# EAGLE design foe-scale (EAGLE 7.4.0)
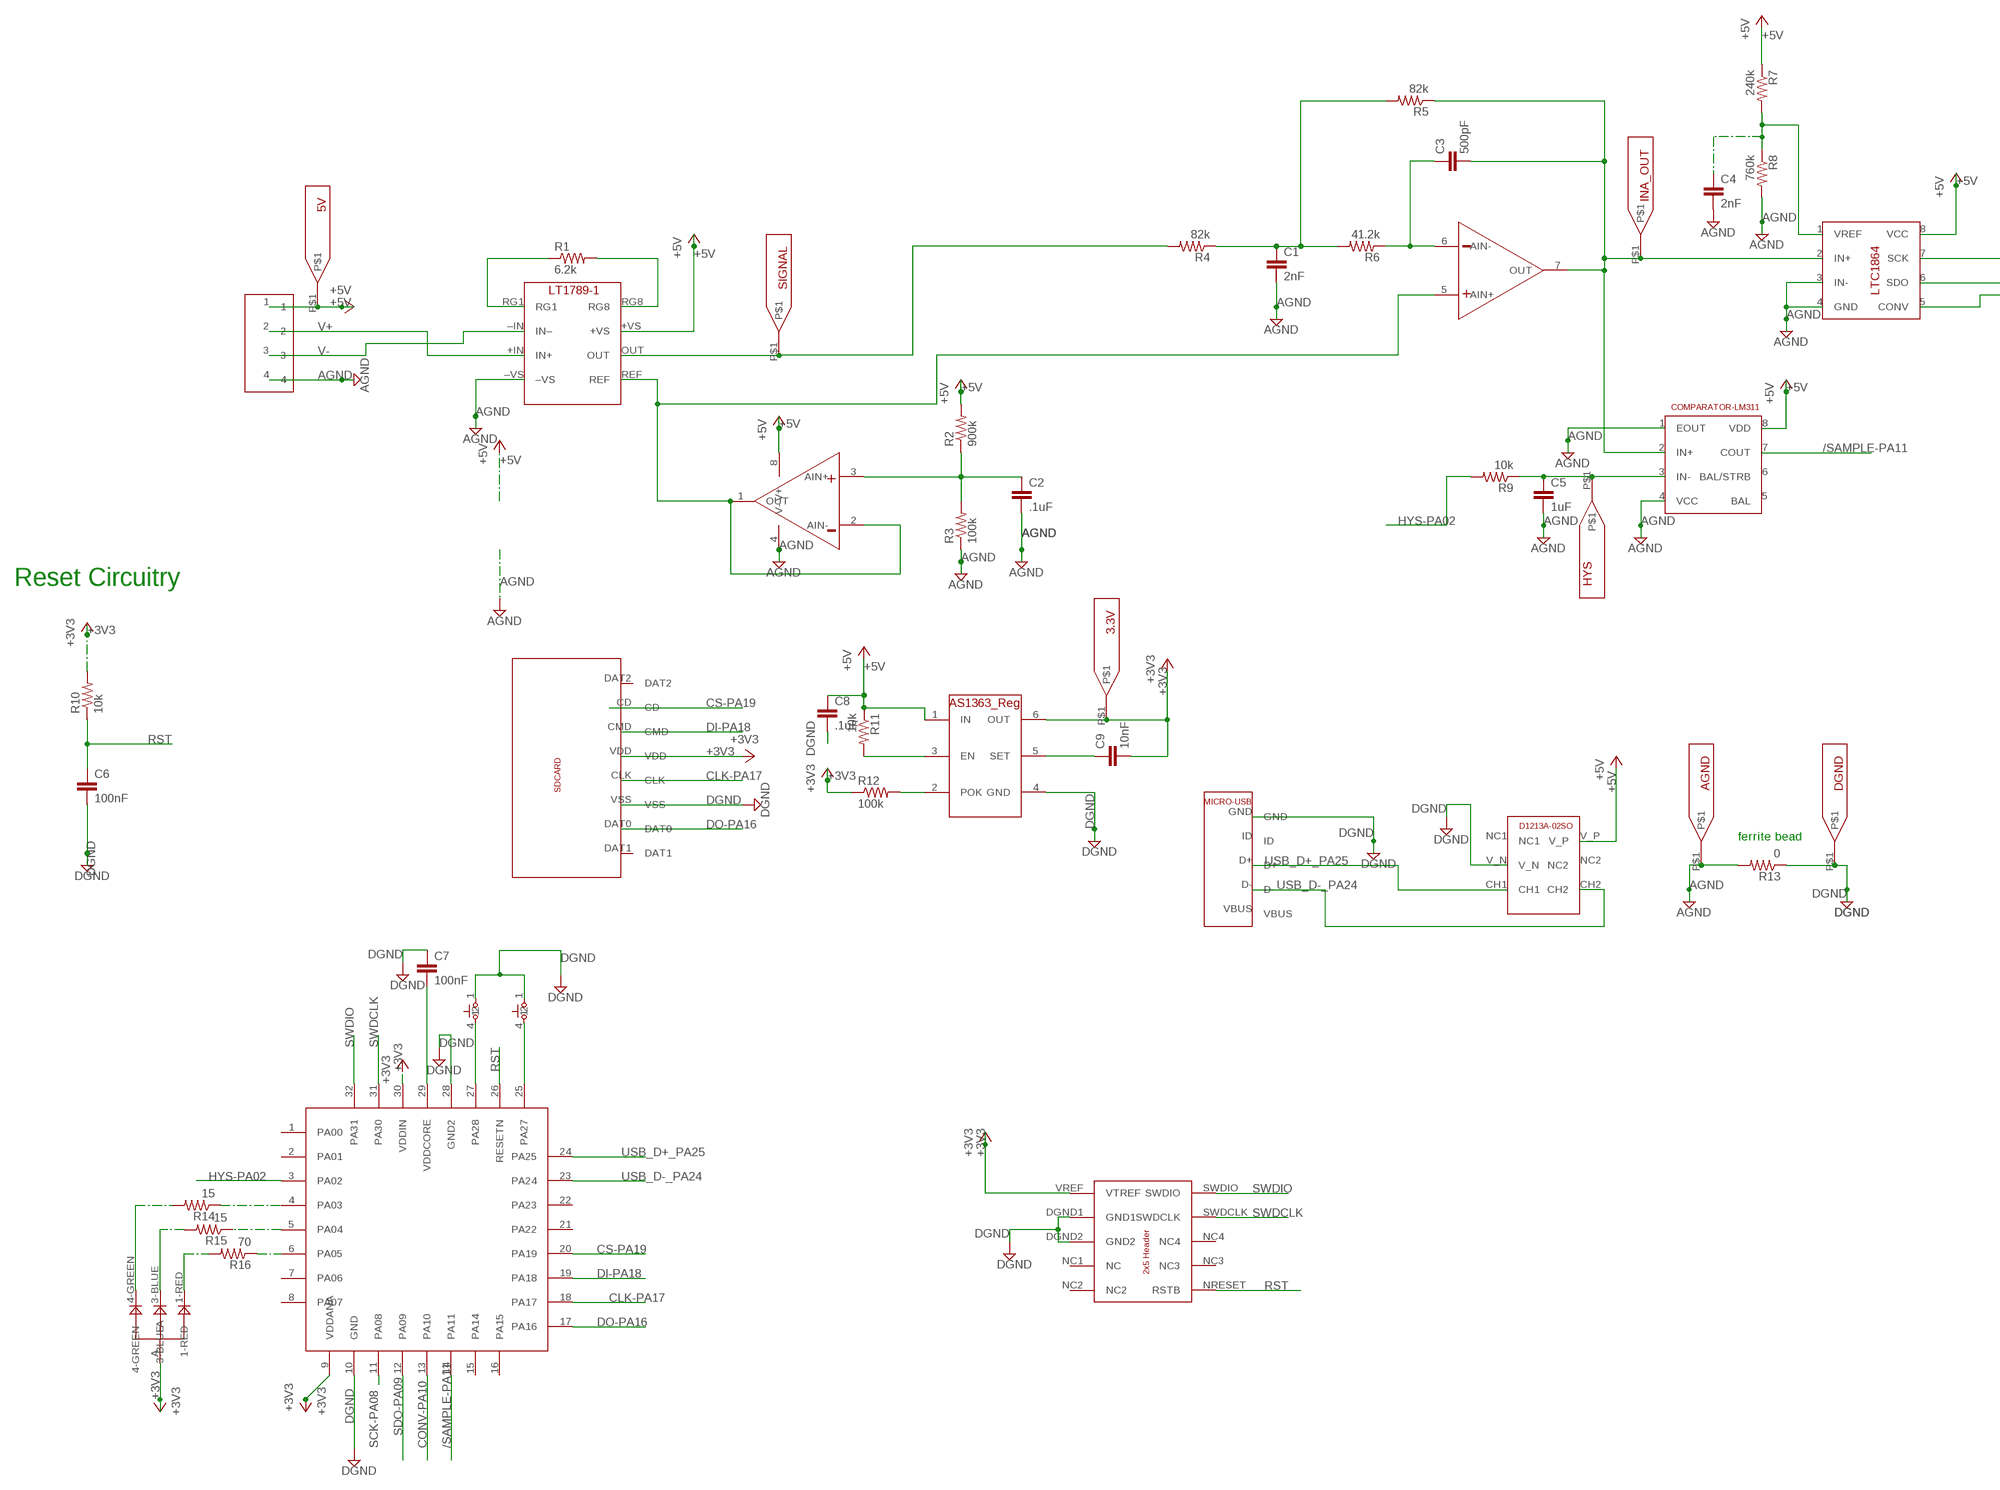
[diagram p0: schematic, sheet 1, part 1 of 2]
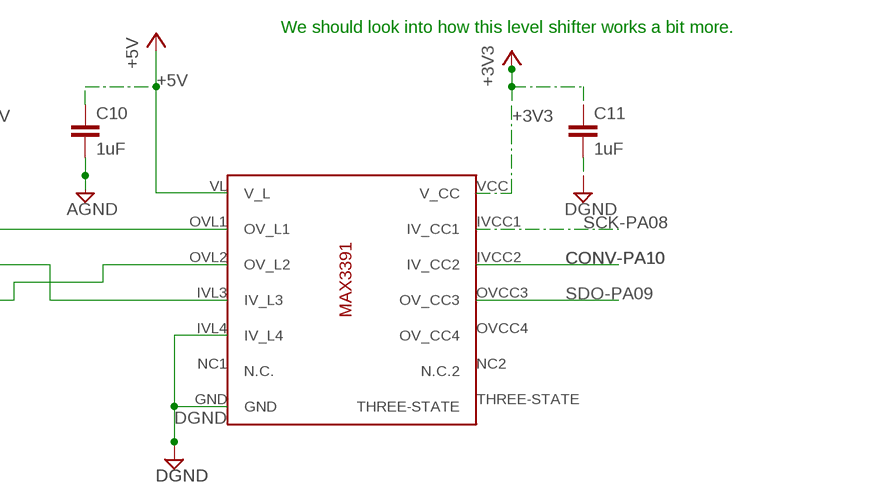
[diagram p1: schematic, sheet 1, part 2 of 2]

## Parts
3.3V  TEST_POINT  [TEST_POINT]
5V  TEST_POINT  [TEST_POINT]
AGND  TEST_POINT  [TEST_POINT]
AS1363  3.3V_AS1363  [SOT23-6]
C1  2nF  C-EUC0805K  [C0805K]
C2  .1uF  C-EUC0805K  [C0805K]
C3  500pF  C-EUC0805K  [C0805K]
C4  2nF  C-EUC0805K  [C0805K]
C5  1uF  C-EUC0805K  [C0805K]
C6  100nF  C-EUC0805K  [C0805K]
C7  100nF  C-EUC0805K  [C0805K]
C8  .1uF  C-EUC0805K  [C0805K]
C9  10nF  C-EUC0805K  [C0805K]
C10  1uF  C-EUC0805K  [C0805K]
C11  1uF  C-EUC0805K  [C0805K]
D1  D1213A-DIODE-ARRAY  [SOT26-DIODE-ARRAY]
DBG1  DEBUGHEAD  [DEBUGHEAD]
DGND  TEST_POINT  [TEST_POINT]
HYS  TEST_POINT  [TEST_POINT]
INA_OUT  TEST_POINT  [TEST_POINT]
R1  6.2k  R-US_R0805  [R0805]
R2  900k  R-US_R0805  [R0805]
R3  100k  R-US_R0805  [R0805]
R4  82k  R-US_R0805  [R0805]
R5  82k  R-US_R0805  [R0805]
R6  41.2k  R-US_R0805  [R0805]
R7  240k  R-US_R0805  [R0805]
R8  760k  R-US_R0805  [R0805]
R9  10k  R-US_R0805  [R0805]
R10  10k  R-US_R0805  [R0805]
R11  10k  R-US_R0805  [R0805]
R12  100k  R-US_R0805  [R0805]
R13  0  R-US_R0805  [R0805]
R14  15  R-US_R0805  [R0805]
R15  15  R-US_R0805  [R0805]
R16  70  R-US_R0805  [R0805]
SIGNAL  TEST_POINT  [TEST_POINT]
U1  LM311  [SOIC8]
U2  SAMD21E  [TQFP32-08]
U$1  1X04  [1X04]
U$2  LT1789-1-INSTR-AMP  [S8-LT1789-1]
U$3  LMC6482  [SOIC8]
U$6  ADC-LTC1864  [SOIC8]
U$7  LEVEL-SHIFTER  [TSSOP-14]
U$8  SDCARD_JACK  [MICRO_SDCARD]
U$10  RGBLED  [RGBLED]
U$11  BUTTON_THRU  [PUSHBTN]
U$12  BUTTON_THRU  [PUSHBTN]
U$13  MICRO-USB-CONNECTOR  [MICRO-USB-CONNECTOR]

## Nets
+3V3: 3.3V.P$1 AS1363.6(OUT) C9.2 C11.1 DBG1.VREF(VTREF) R10.2 R12.1 U2.9(VDDANA) U2.30(VDDIN) U$7.VCC(V_CC) U$8.VDD U$10.A
+5V: 5V.P$1 AS1363.1(IN) C8.1 C10.1 D1.V_P R2.2 R7.1 R11.1 U1.8(VDD) U$1.1 U$2.+VS U$3.8(V+) U$6.8(VCC) U$7.VL(V_L)
/SAMPLE-PA11: U1.7(COUT) U2.14(PA11)
AGND: AGND.P$1 C1.2 C2.2 C4.2 C5.2 C10.2 R3.1 R8.2 R13.2 U1.1(EOUT) U1.4(VCC) U$1.4 U$2.–VS U$3.4(V-) U$6.3(IN-) U$6.4(GND)
CLK-PA17: U2.18(PA17) U$8.CLK
CONV-PA10: U2.13(PA10) U$7.IVCC2(IV_CC2)
CS-PA19: U2.20(PA19) U$8.CD
DGND: AS1363.4(GND) C6.2 C7.1 C8.2 C11.2 D1.V_N DBG1.DGND1(GND1) DBG1.DGND2(GND2) DGND.P$1 R13.1 U2.10(GND) U2.28(GND2) U$7.GND U$7.IVL4(IV_L4) U$8.VSS U$11.1 U$12.1 U$13.GND
DI-PA18: U2.19(PA18) U$8.CMD
DO-PA16: U2.17(PA16) U$8.DAT0
HYS-PA02: R9.2 U2.3(PA02)
N$1: R14.1 U2.4(PA03)
N$2: U2.27(PA28) U$12.4
N$3: U2.25(PA27) U$11.4
N$4: R15.1 U2.5(PA04)
N$5: R1.1 U$2.RG1
N$6: R1.2 U$2.RG8
N$7: R4.2 SIGNAL.P$1 U$2.OUT
N$8: R16.1 U2.6(PA05)
N$10: C2.1 R2.1 R3.2 U$3.3(AIN+)
N$16: U$2.REF U$3.1(OUT) U$3.2(AIN-) U$3.5(AIN+)
N$18: C1.1 R4.1 R5.2 R6.2
N$19: C3.2 INA_OUT.P$1 R5.1 U1.2(IN+) U$3.7(OUT) U$6.2(IN+)
N$20: C3.1 R6.1 U$3.6(AIN-)
N$23: C4.1 R7.2 R8.1 U$6.1(VREF)
N$27: C5.1 HYS.P$1 R9.1 U1.3(IN-)
N$34: U$6.7(SCK) U$7.OVL1(OV_L1)
N$35: U$6.5(CONV) U$7.OVL2(OV_L2)
N$36: U$6.6(SDO) U$7.IVL3(IV_L3)
N$45: C7.2 U2.29(VDDCORE)
N$48: R14.2 U$10.4-GREEN
N$49: R15.2 U$10.3-BLUE
N$50: R16.2 U$10.1-RED
N$64: AS1363.3(EN) R11.2
N$67: AS1363.5(SET) C9.1
N$70: AS1363.2(POK) R12.2
RST: C6.1 DBG1.NRESET(RSTB) R10.1 U2.26(RESETN)
SCK-PA08: U2.11(PA08) U$7.IVCC1(IV_CC1)
SDO-PA09: U2.12(PA09) U$7.OVCC3(OV_CC3)
SWDCLK: DBG1.SWDCLK U2.31(PA30)
SWDIO: DBG1.SWDIO U2.32(PA31)
USB_D+_PA25: D1.CH1 U2.24(PA25) U$13.D+
USB_D-_PA24: D1.CH2 U2.23(PA24) U$13.D-
V+: U$1.2 U$2.+IN(IN+)
V-: U$1.3 U$2.–IN(IN–)
Unconnected: D1.NC1 D1.NC2 DBG1.NC1(NC) DBG1.NC2 DBG1.NC3 DBG1.NC4 U1.5(BAL) U1.6(BAL/STRB) U2.1(PA00) U2.2(PA01) U2.7(PA06) U2.8(PA07) U2.15(PA14) U2.16(PA15) U2.21(PA22) U2.22(PA23) U$7.NC1(N.C.) U$7.NC2(N.C.2) U$7.OVCC4(OV_CC4) U$7.THREE-STATE U$8.DAT1 U$8.DAT2 U$13.ID U$13.VBUS

## Notes on the sheet
- We should look into how this level shifter works a bit more.
- Reset Circuitry
- ferrite bead

## Library data of the parts
3.3V 5V AGND DGND HYS INA_OUT SIGNAL = foe-scale:TEST_POINT
AS1363 = foe-scale:3.3V_AS1363
C1-C11 = rcl:C-EU: CAPACITOR, European symbol
D1 = foe-scale:D1213A-DIODE-ARRAY
DBG1 = foe-scale:DEBUGHEAD
R1-R16 = resistor:R-US_: RESISTOR, American symbol
U1 = foe-scale:LM311
U2 = foe-scale:SAMD21E
U$1 = foe-scale:1X04
U$2 = foe-scale:LT1789-1-INSTR-AMP
U$3 = foe-scale:LMC6482
U$6 = foe-scale:ADC-LTC1864
U$7 = foe-scale:LEVEL-SHIFTER
U$8 = foe-scale:SDCARD_JACK
U$10 = foe-scale:RGBLED
U$11 U$12 = foe-scale:BUTTON_THRU
U$13 = foe-scale:MICRO-USB-CONNECTOR

## Board
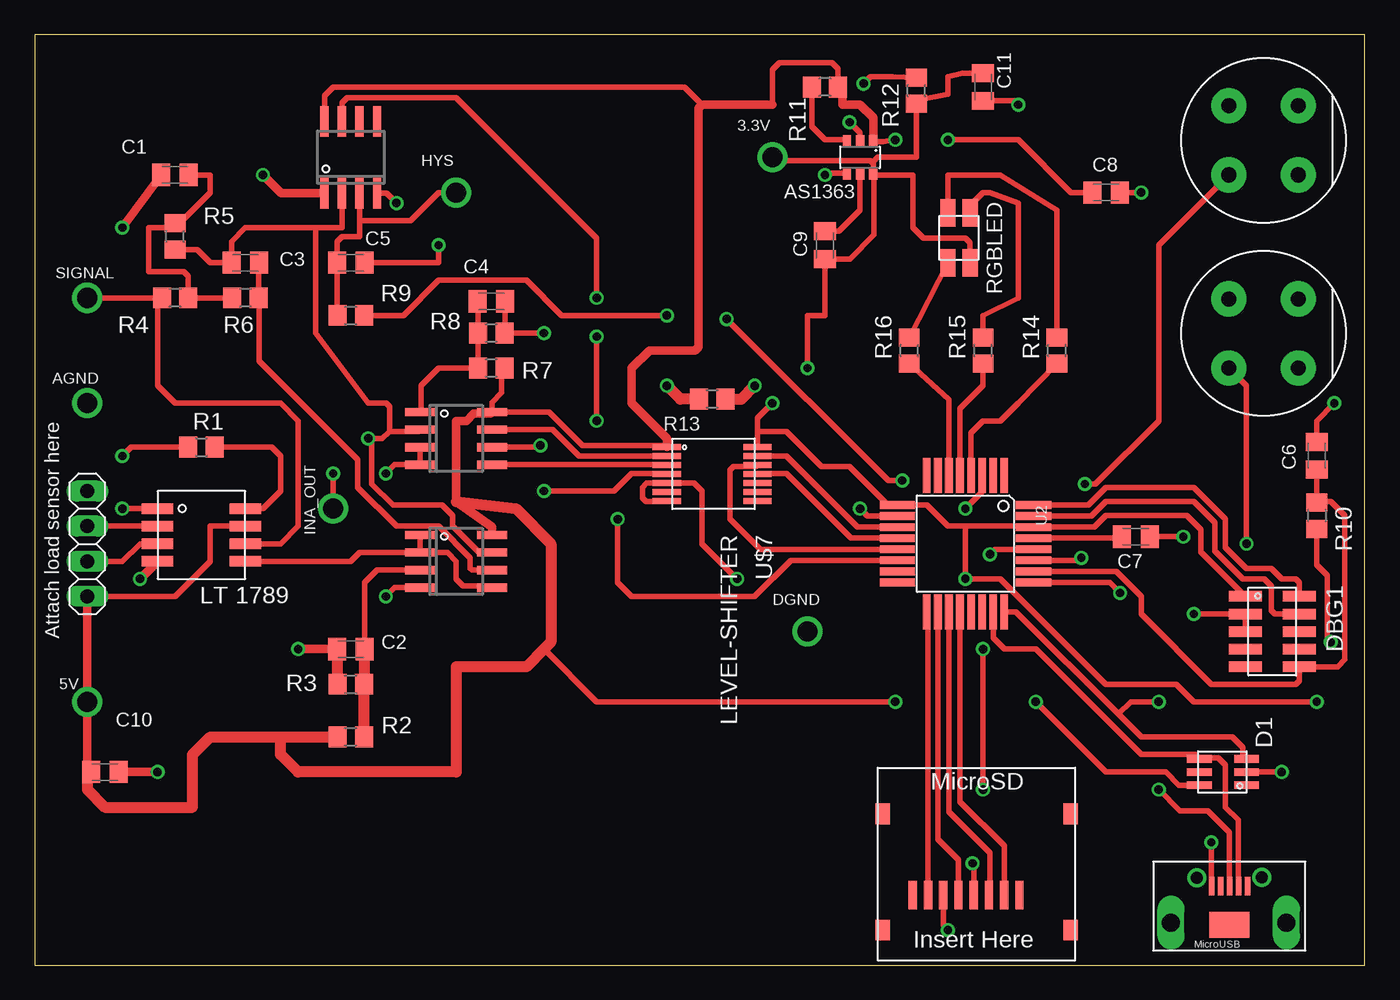
[diagram p2: board, top side]
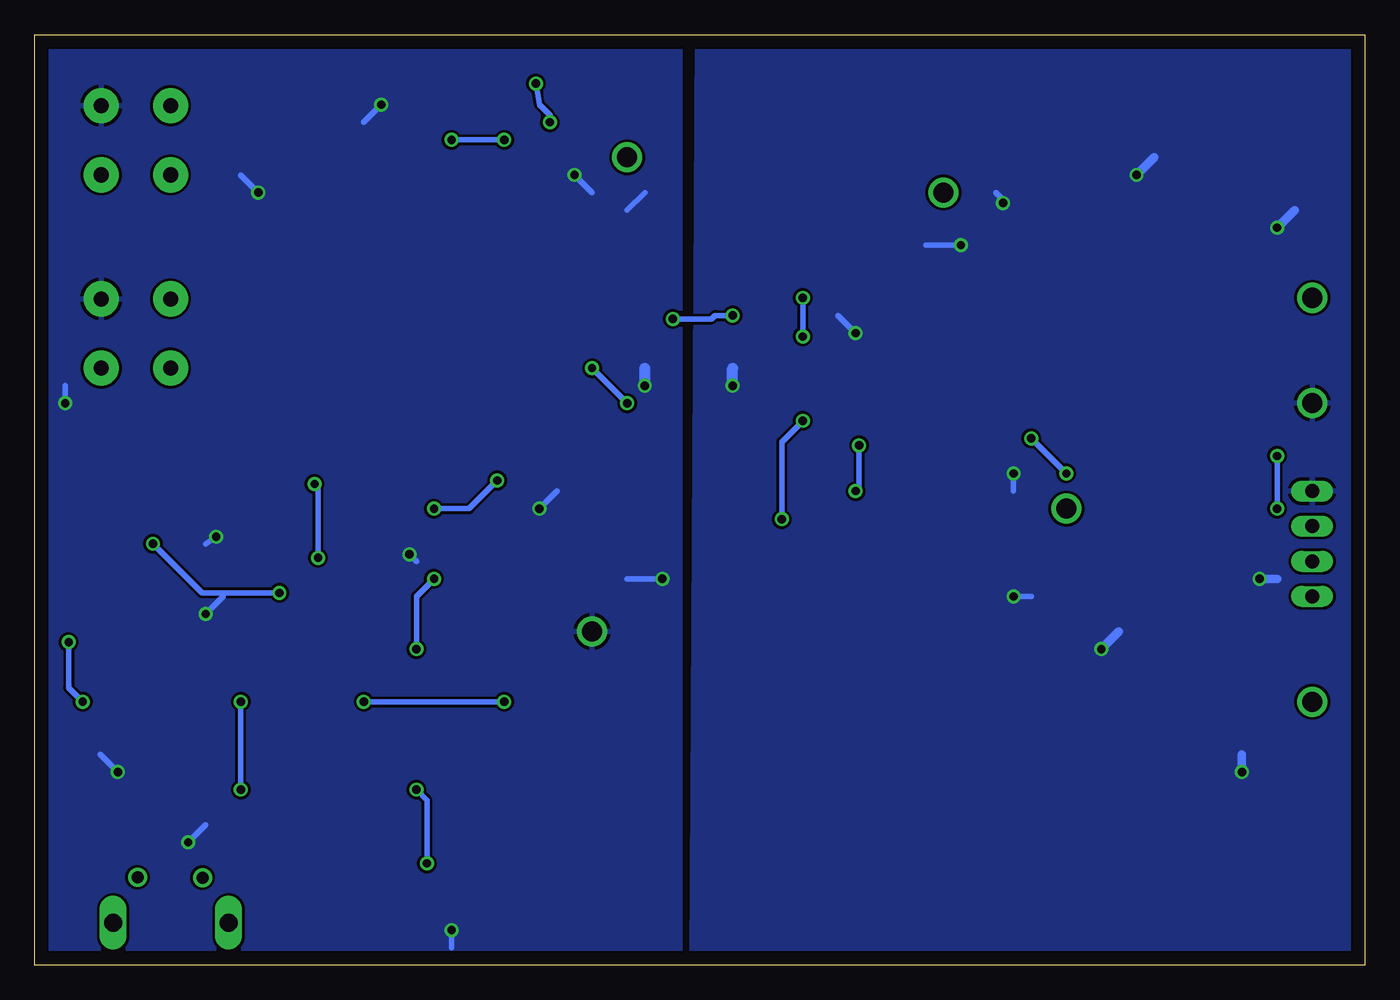
[diagram p3: board, bottom side, seen from below]

Size 96.19 x 67.3 mm. Coordinates in mm from the lower left corner, seen from the top.
Outline: 0,0 96.19,0 96.19,67.3 0,67.3 0,0
Copper layers (1*16): Top 0.035mm / dielectric 1.5mm / Bottom 0.035mm
Design rules "default": minimum track width 10mil, minimum drill 24mil, track to track 8mil, track to pad 8mil, pad to pad 8mil, via to via 8mil, smd to smd 8mil, copper to edge 40mil, drill to drill 8mil, minimum pad ring 10mil, minimum via ring 8mil, stop-mask expansion 4mil, vias tented up to drill 0mil, thermal gap 10mil

### Footprints (pad centres in the part's own frame; a part is rotated, then mirrored left to right if it is on the bottom)
TEST_POINT = drill 1.448: P$1 0,0
SOT23-6 = smd 0.6 x 0.9: 1 -0.95,-1.15; 2 0,-1.15; 3 0.95,-1.15; 4 0.95,1.15; 5 0,1.15; 6 -0.95,1.15
C0805K = smd 1.3 x 1.6: 1 -1,0; 2 1,0
SOT26-DIODE-ARRAY = smd 0.55 x 1.8: CH1 0.95,0; CH2 0.95,3.4; NC1 -0.95,0; NC2 0,3.4; V_N 0,0; V_P -0.95,3.4
DEBUGHEAD = smd 0.76 x 2.4: DGND1 1.27,-3.9; DGND2 2.54,-3.9; NC1 3.81,-3.9; NC2 5.08,-3.9; NC3 3.81,0; NC4 2.54,0; NRESET 5.08,0; SWDCLK 1.27,0; SWDIO 0,0; VREF 0,-3.9
R0805 = smd 1.3 x 1.5: 1 -0.95,0; 2 0.95,0
SOIC8 = smd 0.6 x 2.2: 1 -1.905,-2.6; 2 -0.635,-2.6; 3 0.635,-2.6; 4 1.905,-2.6; 5 1.905,2.6; 6 0.635,2.6; 7 -0.635,2.6; 8 -1.905,2.6
TQFP32-08 = smd 2.54 x 0.559: 1 -4.928,2.8; 2 -4.928,2; 3 -4.928,1.2; 4 -4.928,0.4; 5 -4.928,-0.4; 6 -4.928,-1.2; 7 -4.928,-2; 8 -4.928,-2.8; 17 4.928,-2.8; 18 4.928,-2; 19 4.928,-1.2; 20 4.928,-0.4; 21 4.928,0.4; 22 4.928,1.2; 23 4.928,2; 24 4.928,2.8 | smd 0.559 x 2.54: 9 -2.8,-4.928; 10 -2,-4.928; 11 -1.2,-4.928; 12 -0.4,-4.928; 13 0.4,-4.928; 14 1.2,-4.928; 15 2,-4.928; 16 2.8,-4.928; 25 2.8,4.928; 26 2,4.928; 27 1.2,4.928; 28 0.4,4.928; 29 -0.4,4.928; 30 -1.2,4.928; 31 -2,4.928; 32 -2.8,4.928
1X04 = drill 1.016 long: 1 -3.81,0; 2 -1.27,0; 3 1.27,0; 4 3.81,0
S8-LT1789-1 = smd 0.762 x 2.286: +IN 2.54,0; +VS 1.27,6.35; OUT 2.54,6.35; REF 3.81,6.35; RG1 0,0; RG8 0,6.35; –IN 1.27,0; –VS 3.81,0
TSSOP-14 = smd 0.45 x 2.05: GND 3.9,0; IVCC1 0.65,6.55; IVCC2 1.3,6.55; IVL3 1.95,0; IVL4 2.6,0; NC1 3.25,0; NC2 3.25,6.55; OVCC3 1.95,6.55; OVCC4 2.6,6.55; OVL1 0.65,0; OVL2 1.3,0; THREE-STATE 3.9,6.55; VCC 0,6.55; VL 0,0
MICRO_SDCARD = smd 0.6 x 2.05: CD 6.6,0; CLK 3.3,0; CMD 5.5,0; DAT0 1.1,0; DAT1 0,0; DAT2 7.7,0; VDD 4.4,0; VSS 2.2,0 | smd 1.05 x 1.5: P$9 -2.195,-2.53; P$10 -2.195,5.87; P$11 11.405,5.87; P$12 11.405,-2.53
RGBLED = smd 2 x 1.1: 1-RED 0,0; 3-BLUE 3.6,-1.6; 4-GREEN 3.6,0; A 0,-1.6
PUSHBTN = drill 1.092 pad 2.54: 1 -5.004,5.004; 2 0,5.004; 3 -5.004,0; 4 0,0
MICRO-USB-CONNECTOR = smd 0.4 x 1.35: D+ 1.3,0.65; D- 1.95,0.65; GND 0,0.65; ID 0.65,0.65; VBUS 2.6,0.65 | drill 0.85 pad 1.1: P$6 -1.05,1.25; P$7 3.65,1.28 | drill 1.3 pad 1.9 long: P$8 -2.925,-2; P$9 5.425,-2 | smd 2.9 x 1.9: P$10 1.3,-2.15

### Placement (x,y rotation side)
3.3V  53.34,58.42 0 top
5V  3.81,19.05 0 top
AGND  3.81,40.64 0 top
AS1363  59.69,58.42 180 top
C1  10.16,57.15 180 top
C2  22.86,22.86 180 top
C3  15.24,50.8 180 top
C4  33.02,48.01 0 top
C5  22.86,50.8 0 top
C6  92.71,36.83 90 top
C7  79.63,30.99 180 top
C8  77.47,55.88 0 top
C9  57.15,52.07 270 top
C10  5.08,13.97 0 top
C11  68.58,63.5 270 top
D1  87.63,13.97 90 top
DBG1  91.44,26.67 270 top
DGND  55.88,24.13 0 top
HYS  30.48,55.88 0 top
INA_OUT  21.59,33.02 0 top
R1  12.06,37.47 0 top
R2  22.86,16.51 180 top
R3  22.86,20.32 0 top
R4  10.16,48.26 180 top
R5  10.16,52.7 90 top
R6  15.24,48.26 180 top
R7  33.02,43.18 180 top
R8  33.02,45.72 0 top
R9  22.86,46.99 0 top
R10  92.71,32.51 270 top
R11  57.15,63.5 180 top
R12  63.75,63.25 90 top
R13  49,40.94 180 top
R14  73.91,44.45 90 top
R15  68.58,44.45 90 top
R16  63.25,44.45 90 top
SIGNAL  3.81,48.26 0 top
U1  22.86,58.42 0 top
U2  67.31,30.48 270 top
U$1  3.81,30.48 90 top
U$2  8.89,33.02 270 top
U$3  30.48,29.21 270 top
U$6  30.48,38.1 270 top
U$7  45.72,37.47 270 top
U$8  63.5,5.08 0 top
U$10  66.04,50.8 90 top
U$11  86.36,43.18 270 top
U$12  86.36,57.15 270 top
U$13  85.09,5.08 0 top

### Tracks (layer width: path | path; a pad name or v marks a point on that pad's centre or on a via)
+3V3  (via drill 0.6)
  Top 0.406: U$10.A 67.64,52.25 67.31,52.58 64.26,52.58 63.5,53.34 63.5,57.15 60.76,57.15 AS1363.6 | AS1363.6 60.71,57.2 60.71,52.83 58.94,51.07 C9.2 57.15,46.99 55.88,46.99 v55.88,43.18 | AS1363.6 60.64,57.98 60.45,58.17 53.59,58.17 3.3V.P$1 | AS1363.6 60.64,58.1 60.96,58.42 63.75,58.42 R12.1 63.82,62.55 66.04,62.99 66.04,64.26 67.07,64.52 C11.1 | U$7.VCC 52.27,38.61 | 52.27,38.61 52.27,39.57 v53.34,40.64 | 52.27,38.61 54.36,38.61 56.9,36.07 58.93,36.07 61.72,33.28 U2.9 64.51,33.28 66.04,31.75 67.31,31.75 | 67.31,31.75 72.17,31.75 U2.30 76.64,31.68 77.47,32.51 83.31,32.51 84.33,31.5 84.33,29.88 DBG1.VREF | U$8.VDD 67.9,7.28 v67.82,7.37 | v68.58,12.7 v68.58,22.86 | 67.31,31.75 v67.31,27.94 69.85,27.94 77.47,20.32 82.55,20.32 83.82,19.05 v92.71,19.05 | R10.2 92.71,28.96 93.47,28.19 93.47,23.62 v93.73,23.37
  Bottom 0.406: v53.34,40.64 v55.88,43.18 | v67.82,7.37 67.82,11.94 v68.58,12.7 | v68.58,22.86 68.58,26.67 v67.31,27.94 | v93.73,23.37 93.73,20.07 v92.71,19.05
+5V  (via drill 0.6)
  Top 0.406: U$1.1 10.16,26.67 12.7,29.21 12.7,31.75 U$2.+VS | 3.81,14.24 C10.1 3.81,13.7 | U$7.VL 45.59,37.59 39.62,37.59 37.21,40 U$6.8 33.08,40.7 33.78,41.4 33.78,42.99 R7.1 | R11.1 58.1,64.84 57.66,65.28 53.85,65.28 53.34,64.77 53.34,62.23 | AS1363.1 61.35,59.57 v62.23,59.69 | C8.1 74.93,55.88 71.12,59.69 v66.04,59.69 | U1.8 20.95,62.86 21.59,63.5 46.99,63.5 48.26,62.23 | D1.V_P 82.74,13.02 81.79,13.97 77.47,13.97 v72.39,19.05 | v62.23,19.05 40.64,19.05 36.83,22.86
  Top 0.61: U$1.1 5V.P$1 3.81,14.24 | U$7.VL 45.72,38.1 43.18,40.64 43.18,43.18 44.45,44.45 47.75,44.45 48.01,44.7 48.01,61.98 48.26,62.23 53.34,62.23 | AS1363.1 60.64,61.28 59.69,62.23 58.42,62.23 58.42,63.18 R11.1 | U$3.8 33.08,31.69 30.48,33.53 30.48,39.37 31.24,39.37 31.75,39.88 32.95,39.88 U$6.8
  Top 0.813: 30.48,33.53 34.8,33.02 37.34,30.48 37.34,23.37 36.83,22.86 35.56,21.59 30.48,21.59 30.48,13.97 19.05,13.97 17.78,15.24 17.78,16.51 | 3.81,13.7 3.81,12.7 5.08,11.43 11.43,11.43 11.43,15.24 12.7,16.51 17.78,16.51 | 17.78,16.51 R2.2
  Bottom 0.406: v66.04,59.69 v62.23,59.69 | v72.39,19.05 v62.23,19.05
/SAMPLE-PA11  (via drill 0.6)
  Top 0.406: U1.7 22.23,62.36 22.48,62.61 22.61,62.74 30.48,62.74 40.64,52.58 v40.64,48.26 | U2.14 54.68,29.28 52.07,26.67 43.18,26.67 42.16,27.69 v42.16,32.26 | v40.64,39.37 v40.64,45.47
  Bottom 0.406: v42.16,32.26 42.16,37.85 v40.64,39.37 | v40.64,45.47 v40.64,48.26
AGND  (via drill 0.6)
  Top 0.406: U$3.4 26.03,27.31 v25.4,26.67 | U$6.3 U$6.4 26.03,36.2 v25.4,35.56 | C5.2 29.21,50.8 v29.21,52.07 | v36.83,45.72 R8.2 34.02,45.77 C4.2 | U1.4 25.46,55.82 v26.16,55.12
  Top 0.61: C10.2 v8.89,13.97 | U$2.–VS v7.62,27.94 | C2.2 v19.05,22.86 | C1.2 v6.35,53.34 | U1.1 17.84,55.82 v16.51,57.15
  Top 0.813: R13.2 46.69,40.94 v45.72,41.91 | R3.1 21.91,22.81 C2.2
  Bottom 0.406: v25.4,26.67 24.13,26.67 | v25.4,35.56 25.4,34.29 | v29.21,52.07 31.75,52.07 | v36.83,45.72 38.1,46.99 | v26.16,55.12 26.16,55.37 26.67,55.88
  Bottom 0.61: v8.89,13.97 8.89,15.24 | v7.62,27.94 6.35,27.94 | v19.05,22.86 17.78,24.13 | v6.35,53.34 5.08,54.61 | v16.51,57.15 15.24,58.42
  Bottom 0.813: v45.72,41.91 45.72,43.18
  pour Bottom: 0,67.31 48.26,67.31 48.64,0.25 0,0
CLK-PA17
  Top 0.406: U2.18 65.31,9.11 66.8,7.62 U$8.CLK
CONV-PA10
  Top 0.406: U2.13 52.47,30.08 50.29,32.26 50.29,35.81 50.55,36.07 52.17,36.07 U$7.IVCC2
CS-PA19
  Top 0.406: U2.20 66.91,11.83 70.1,8.64 U$8.CD
DGND  (via drill 0.6)
  Top 0.406: C11.2 70.85,62.5 v71.12,62.23 | C8.2 v80.01,55.88 | AS1363.4 57.27,57.27 v57.15,57.15 | U$7.GND 45.68,33.53 44.2,33.53 43.94,33.78 43.94,34.54 44.26,34.86 U$7.IVL4 47.68,34.86 48.26,34.29 48.26,30.48 v50.8,27.94 | U2.10 60.23,32.48 v59.69,33.02 | U2.28 69.45,30.08 v69.09,29.72 | U$8.VSS 65.7,2.88 v66.04,2.54 | D1.V_N v90.17,13.97 | U$13.GND v85.09,8.89 | DBG1.DGND2 DBG1.DGND1 v83.82,25.4 | C7.1 v83.06,30.99 | C6.2 92.71,39.37 v93.98,40.64
  Top 0.813: R13.1 51.1,40.94 v52.07,41.91
  Bottom 0.406: v71.12,62.23 72.39,60.96 | v80.01,55.88 81.28,57.15 | 53.34,54.61 52.07,55.88 | v57.15,57.15 55.88,55.88 | v59.69,33.02 58.42,34.29 | v69.09,29.72 68.58,29.21 | v66.04,2.54 66.04,1.27 | v90.17,13.97 91.44,15.24 | v85.09,8.89 83.82,10.16 | v83.82,25.4 82.55,26.67 | v83.06,30.99 83.82,30.48 | v93.98,40.64 93.98,41.91 | v50.8,27.94 53.34,27.94
  Bottom 0.813: v52.07,41.91 52.07,43.18
  pour Bottom: 49.53,0 96.52,0 96.52,67.31 49.53,67.31
DI-PA18
  Top 0.406: U2.19 66.11,11.11 69.09,8.13 69.09,5.17 U$8.CMD
DO-PA16
  Top 0.406: U$8.DAT0 64.6,25.46 U2.17
HYS-PA02  (via drill 0.6)
  Top 0.406: 24.13,46.99 R9.2 26.67,46.99 29.21,49.53 35.56,49.53 38.1,46.99 v45.72,46.99 | U2.3 68.51,34.22 v67.31,33.02 | v62.74,35.05 61.72,35.05 v50.04,46.74
  Bottom 0.406: v67.31,33.02 64.77,33.02 v62.74,35.05 | v50.04,46.74 47.24,46.74 46.99,46.99 v45.72,46.99
N$1
  Top 0.406: U2.4 67.71,38.5 68.58,39.37 69.85,39.37 71.12,40.64 R14.1
N$2  (via drill 0.6)
  Top 0.406: U2.27 75.51,29.28 v75.69,29.46 | v75.95,34.8 76.71,34.8 81.28,39.37 81.28,52.07 U$12.4
  Bottom 0.406: v75.69,29.46 75.69,34.54 v75.95,34.8
N$3  (via drill 0.6)
  Top 0.406: U2.25 77.73,27.68 v78.49,26.92 | v87.63,30.48 87.63,41.91 U$11.4
  Bottom 0.406: v78.49,26.92 84.07,26.92 v87.63,30.48
N$4
  Top 0.406: U2.5 66.91,40.24 68.58,41.91 R15.1
N$5  (via drill 0.6)
  Top 0.406: U$2.RG1 v6.35,33.02 | v6.35,36.83 6.99,37.47 R1.1
  Bottom 0.406: v6.35,33.02 v6.35,36.83
N$6
  Top 0.406: U$2.RG8 16.51,33.02 17.78,34.29 17.78,36.83 17.15,37.47 R1.2
N$7
  Top 0.406: U$2.OUT 17.78,30.48 19.05,31.75 19.05,39.37 17.78,40.64 10.16,40.64 8.89,41.91 8.89,47.94 R4.2 SIGNAL.P$1
N$8
  Top 0.406: U2.6 66.11,40.89 R16.1
N$10
  Top 0.406: C2.1 23.86,27.67 24.77,28.57 U$3.3
  Top 0.813: R2.1 R3.2 | 23.86,20.37 C2.1
  Top 1.016: 23.86,20.37 R3.2
N$16
  Top 0.406: U$2.REF 22.86,29.21 23.49,29.85 U$3.2 | U$3.1 U$3.2 | U$3.2 29.84,29.85 30.48,29.21 30.48,27.94 30.99,27.43 32.95,27.43 U$3.5
N$18
  Top 0.406: R6.2 R4.1 11.11,49.85 10.79,50.17 8.26,50.17 8.26,53.34 9.85,53.34 R5.2 10.47,53.66 12.7,55.88 12.7,57.15 C1.1
N$19  (via drill 0.6)
  Top 0.406: R5.1 11.74,51.75 12.7,50.8 C3.2 14.24,52.34 15.24,53.34 20.32,53.34 | 20.32,53.34 22.23,53.34 U1.2 | INA_OUT.P$1 v21.59,35.56 | 25.65,38.61 25.15,38.1 v24.13,38.1 24.38,37.85 24.38,34.8 25.91,33.27 29.46,33.27 30.23,32.51 30.23,31.75 32.13,29.85 U$3.7 | 25.65,38.61 27.75,38.61 U$6.2 | 25.65,38.61 25.65,40.39 25.4,40.64 24.13,40.64 20.32,45.72 20.32,53.34
  Bottom 0.406: v21.59,35.56 v24.13,38.1
N$20
  Top 0.406: C3.1 16.19,50.75 R6.1 16.26,48.19 16.26,43.69 23.37,36.58 23.37,34.54 26.16,31.75 29.21,31.75 31.5,29.46 31.5,28.7 31.62,28.57 U$3.6
N$23
  Top 0.406: U$6.1 27.94,40.06 27.94,41.91 29.21,43.18 R7.2 R8.1 32.07,47.96 C4.1
N$27
  Top 0.406: R9.1 21.86,47.04 C5.1 21.86,52.34 22.23,52.7 23.49,52.7 23.49,53.85 | 23.49,53.85 U1.3 | HYS.P$1 29.21,55.88 27.18,53.85 23.49,53.85
N$34
  Top 0.406: U$6.7 37.46,38.73 39.37,36.83 45.7,36.83 U$7.OVL1
N$35
  Top 0.406: U$6.5 45.69,36.2 U$7.OVL2
N$36  (via drill 0.6)
  Top 0.406: U$6.6 36.45,37.47 v36.58,37.59 | v36.83,34.29 41.91,34.29 43.18,35.56 45.67,35.56 U$7.IVL3
  Bottom 0.406: v36.58,37.59 36.58,34.54 v36.83,34.29
N$45
  Top 0.406: U2.29 78.52,30.88 C7.2
N$48
  Top 0.406: R14.2 73.91,54.61 69.85,57.15 66.04,57.15 U$10.4-GREEN
N$49
  Top 0.406: U$10.3-BLUE 67.64,54.94 68.58,55.88 69.09,55.88 71.12,55.12 71.12,48.26 68.58,46.99 R15.2
N$50
  Top 0.406: R16.2 U$10.1-RED
N$64
  Top 0.406: R11.2 56.2,60.64 57.15,59.69 58.62,59.69 AS1363.3
N$67
  Top 0.406: C9.1 58.15,53.07 59.69,54.61 AS1363.5
N$70  (via drill 0.6)
  Top 0.406: AS1363.2 59.69,60.2 v58.93,60.96 | v59.94,63.75 60.45,64.26 62.04,64.26 R12.2
  Bottom 0.406: v58.93,60.96 58.93,61.47 59.69,62.23 v59.94,63.75
RST
  Top 0.406: U2.26 78.2,28.48 80.01,26.67 80.01,25.4 85.09,20.32 91.19,20.32 91.44,20.57 DBG1.NRESET 94.23,21.59 94.74,22.1 94.74,32.51 93.73,33.53 92.78,33.53 R10.1 C6.1
SCK-PA08
  Top 0.406: U2.11 59.51,31.68 54.36,36.83 52.28,36.83 U$7.IVCC1
SDO-PA09
  Top 0.406: U2.12 59.04,30.88 54.36,35.56 52.31,35.56 U$7.OVCC3
SWDCLK
  Top 0.406: U2.31 76.42,32.48 77.47,33.53 83.82,33.53 85.34,32 85.34,29.97 87.38,27.94 88.9,27.94 89.41,27.43 89.41,25.65 89.66,25.4 DBG1.SWDCLK
SWDIO
  Top 0.406: U2.32 76.21,33.28 77.47,34.54 83.82,34.54 86.11,32.26 86.11,30.23 87.63,28.7 89.41,28.7 90.17,27.94 91.19,27.94 91.44,27.69 DBG1.SWDIO
USB_D+_PA25  (via drill 0.6)
  Top 0.406: U2.24 70.97,25.55 78.36,18.16 | 78.36,18.16 80.01,16.51 86.61,16.51 87.38,15.75 87.38,15.17 D1.CH1 | U$13.D+ 86.39,9.62 84.84,11.18 82.8,11.18 v81.28,12.7 | v81.28,19.05 79.25,19.05 78.36,18.16
  Bottom 0.406: v81.28,12.7 v81.28,19.05
USB_D-_PA24
  Top 0.406: U2.23 69.31,23.65 70.1,22.86 72.39,22.86 80.01,15.24 83.91,15.24 D1.CH2 84.3,14.99 85.6,14.99 86.11,14.48 86.11,11.43 87.04,10.5 U$13.D-
V+
  Top 0.406: U$1.2 6.35,29.21 7.62,30.48 U$2.+IN
V-
  Top 0.406: U$1.3 U$2.–IN

### Text on the board
tPlace: LT 1789
tNames: Attach load sensor here